# Altium schematic sheet 02ux.SchDoc
size B
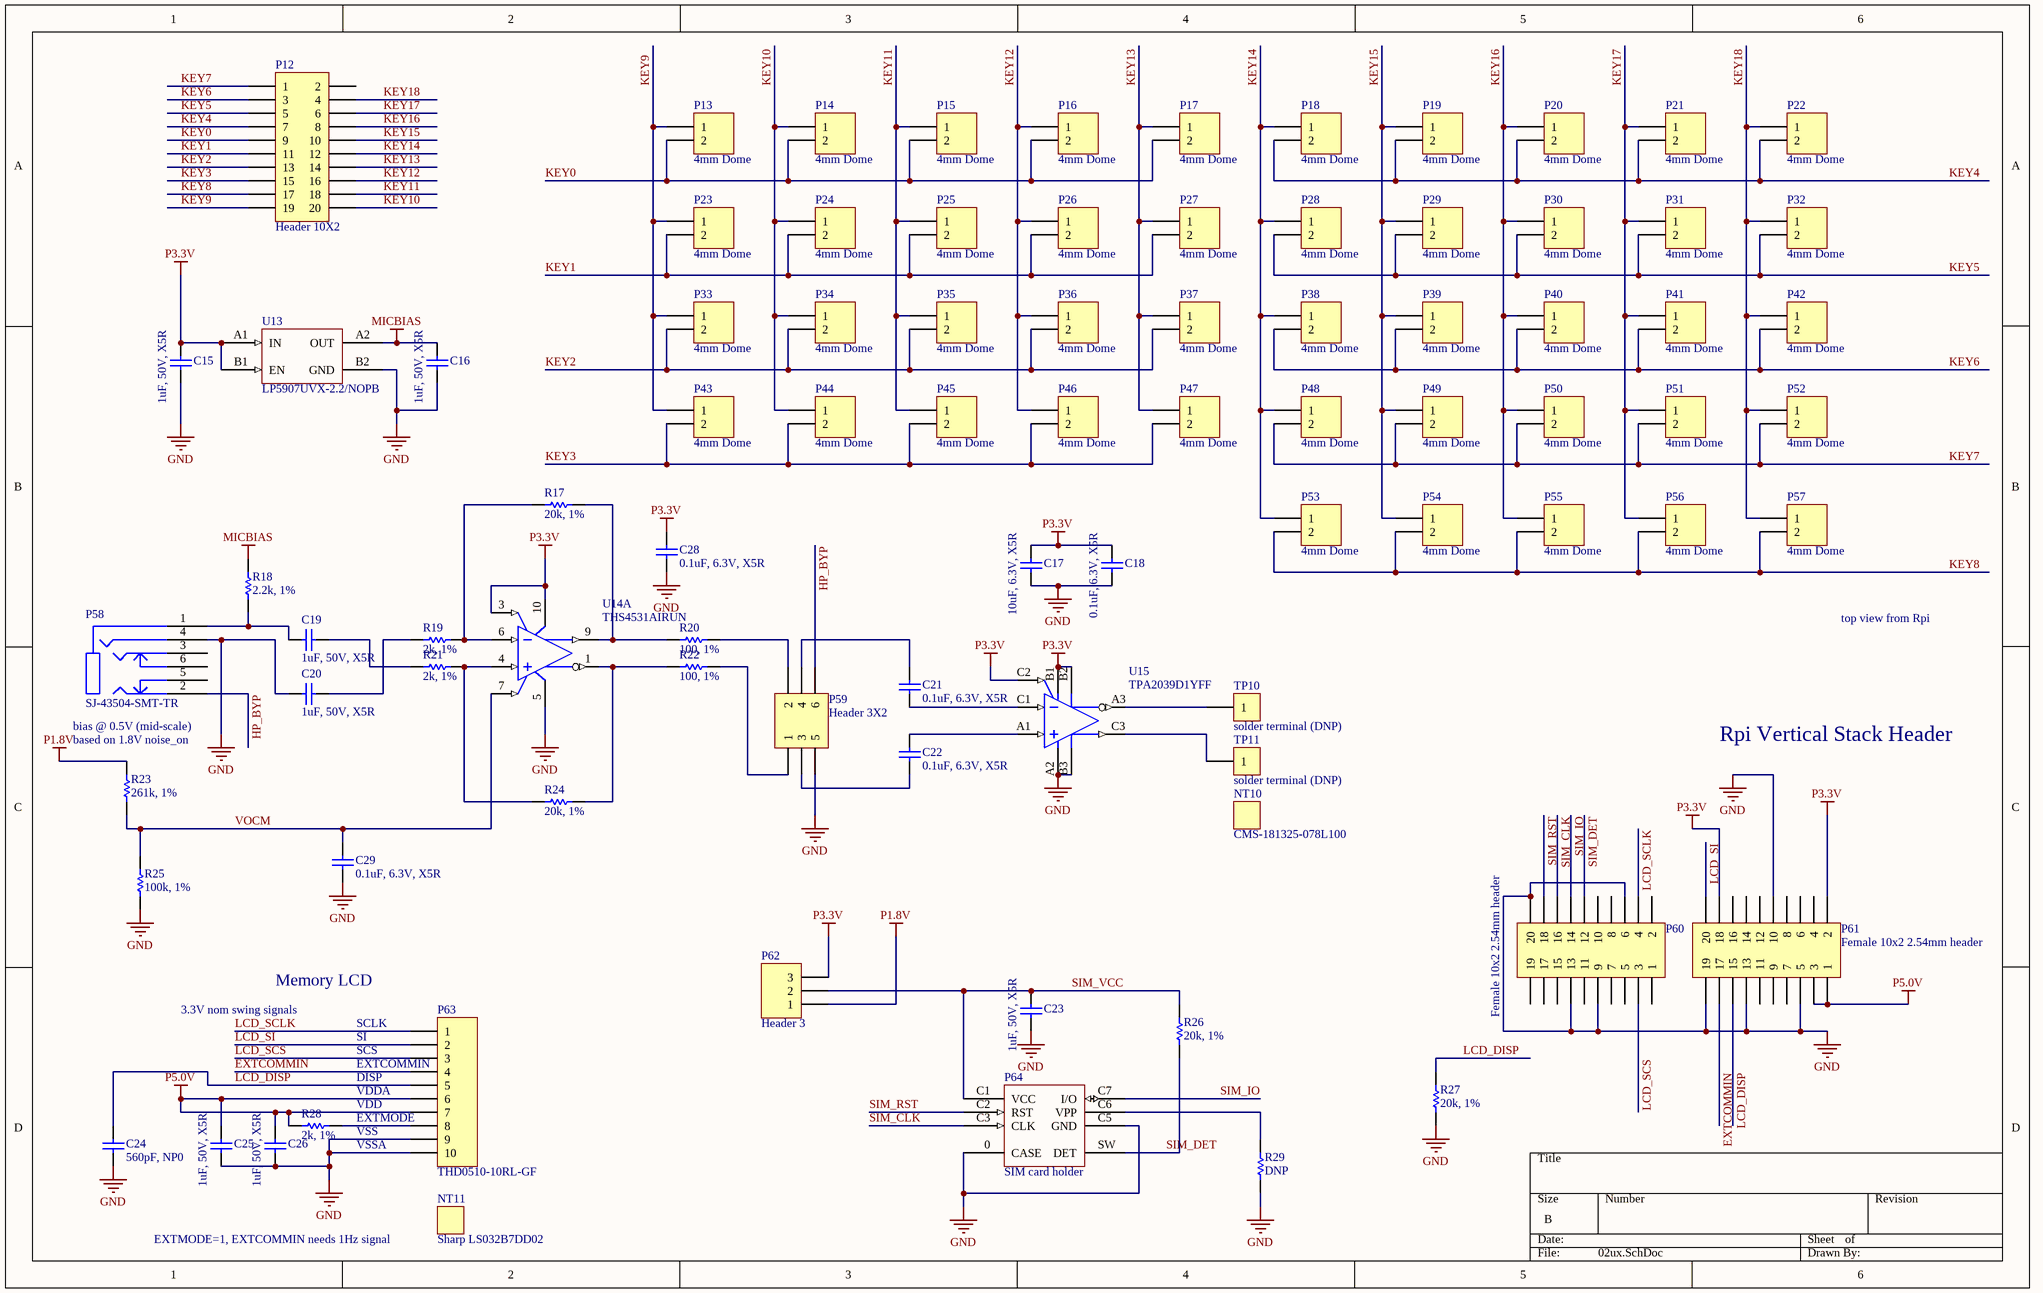
[diagram p0: 02ux.SchDoc]

## Parts
C15  1uF, 50V, X5R  [B_CAP0603]
C16  1uF, 50V, X5R  [B_CAP0603]
C17  10uF, 6.3V, X5R  [B_CAP0603]
C18  0.1uF, 6.3V, X5R  [B_CAP0603]
C19  1uF, 50V, X5R  [B_CAP0603]
C20  1uF, 50V, X5R  [B_CAP0603]
C21  0.1uF, 6.3V, X5R  [B_CAP0603]
C22  0.1uF, 6.3V, X5R  [B_CAP0603]
C23  1uF, 50V, X5R  [B_CAP0603]
C24  560pF, NP0  [B_CAP0402]
C25  1uF, 50V, X5R  [B_CAP0603]
C26  1uF, 50V, X5R  [B_CAP0603]
C28  0.1uF, 6.3V, X5R  [B_CAP0603]
C29  0.1uF, 6.3V, X5R  [B_CAP0603]
NT10  CMS-181325-078L100
NT11  Sharp LS032B7DD02
P12  Header 10X2  [HDR2X10]
P13  4mm Dome  [4MM_DOME_SW]
P14  4mm Dome  [4MM_DOME_SW]
P15  4mm Dome  [4MM_DOME_SW]
P16  4mm Dome  [4MM_DOME_SW]
P17  4mm Dome  [4MM_DOME_SW]
P18  4mm Dome  [4MM_DOME_SW]
P19  4mm Dome  [4MM_DOME_SW]
P20  4mm Dome  [4MM_DOME_SW]
P21  4mm Dome  [4MM_DOME_SW]
P22  4mm Dome  [4MM_DOME_SW]
P23  4mm Dome  [4MM_DOME_SW]
P24  4mm Dome  [4MM_DOME_SW]
P25  4mm Dome  [4MM_DOME_SW]
P26  4mm Dome  [4MM_DOME_SW]
P27  4mm Dome  [4MM_DOME_SW]
P28  4mm Dome  [4MM_DOME_SW]
P29  4mm Dome  [4MM_DOME_SW]
P30  4mm Dome  [4MM_DOME_SW]
P31  4mm Dome  [4MM_DOME_SW]
P32  4mm Dome  [4MM_DOME_SW]
P33  4mm Dome  [4MM_DOME_SW]
P34  4mm Dome  [4MM_DOME_SW]
P35  4mm Dome  [4MM_DOME_SW]
P36  4mm Dome  [4MM_DOME_SW]
P37  4mm Dome  [4MM_DOME_SW]
P38  4mm Dome  [4MM_DOME_SW]
P39  4mm Dome  [4MM_DOME_SW]
P40  4mm Dome  [4MM_DOME_SW]
P41  4mm Dome  [4MM_DOME_SW]
P42  4mm Dome  [4MM_DOME_SW]
P43  4mm Dome  [4MM_DOME_SW]
P44  4mm Dome  [4MM_DOME_SW]
P45  4mm Dome  [4MM_DOME_SW]
P46  4mm Dome  [4MM_DOME_SW]
P47  4mm Dome  [4MM_DOME_SW]
P48  4mm Dome  [4MM_DOME_SW]
P49  4mm Dome  [4MM_DOME_SW]
P50  4mm Dome  [4MM_DOME_SW]
P51  4mm Dome  [4MM_DOME_SW]
P52  4mm Dome  [4MM_DOME_SW]
P53  4mm Dome  [4MM_DOME_SW]
P54  4mm Dome  [4MM_DOME_SW]
P55  4mm Dome  [4MM_DOME_SW]
P56  4mm Dome  [4MM_DOME_SW]
P57  4mm Dome  [4MM_DOME_SW]
P58  SJ-43504-SMT-TR  [CUI_SJ_43504_SMT_TR_PULLBACK]
P59  Header 3X2  [HDR2X3]
P60  Female 10x2 2.54mm header  [HDR2X10]
P61  Female 10x2 2.54mm header  [HDR2X10]
P62  Header 3  [HDR1X3]
P63  THD0510-10RL-GF  [KAWEEI_THD0510_10RL_GF]
P64  SIM card holder  [MOLEX_504520_0691]
R17  20k, 1%  [B_RES0402]
R18  2.2k, 1%  [B_RES0402]
R19  2k, 1%  [B_RES0402]
R20  100, 1%  [B_RES0402]
R21  2k, 1%  [B_RES0402]
R22  100, 1%  [B_RES0402]
R23  261k, 1%  [B_RES0402]
R24  20k, 1%  [B_RES0402]
R25  100k, 1%  [B_RES0402]
R26  20k, 1%  [B_RES0402]
R27  20k, 1%  [B_RES0402]
R28  2k, 1%  [B_RES0402]
R29  DNP  [B_RES0402]
TP10  solder terminal (DNP)  [55-MIL-HOLE]
TP11  solder terminal (DNP)  [55-MIL-HOLE]
U13  LP5907UVX-2.2/NOPB  [TI_YKE004]
U14  THS4531AIRUN  [RUN0010A]  (part A of 2)
U15  TPA2039D1YFF  [YFF0009AAAC]

## Nets
GND: C15.2 C16.2 C17.2 C18.2 C20.1 C23.2 C24.2 C25.2 C26.2 C28.1 C29.1 P58.4(RING2) P59.5 P60.6 P60.9 P60.13 P60.20 P61.5 P61.10 P61.13 P61.19 P63.9 P63.10 P64.0(CASE) P64.C5(GND) R25.1 R27.1 R29.1 U13.B2(GND) U14.5(VS-) U15.A2(GND) U15.B3(PGND)
MICBIAS: C16.1 R18.2 U13.A2(OUT)
P1.8V: P62.1 R23.2
P3.3V: C15.1 C17.1 C18.1 C28.2 P61.2 P61.18 P62.3 U13.A1(IN) U13.B1(EN) U14.3(~{PD}) U14.10(VS+) U15.B1(VDD) U15.B2(PVDD) U15.C2(EN)
P5.0V: C25.1 C26.1 P61.1 P61.3 P63.6 P63.7 R28.2
EXTCOMMIN: P61.17 P63.4
HP_BYP: P58.2(TIP) P59.6
KEY0: P12.9 P13.2 P14.2 P15.2 P16.2 P17.2
KEY1: P12.11 P23.2 P24.2 P25.2 P26.2 P27.2
KEY2: P12.13 P33.2 P34.2 P35.2 P36.2 P37.2
KEY3: P12.15 P43.2 P44.2 P45.2 P46.2 P47.2
KEY4: P12.7 P18.2 P19.2 P20.2 P21.2 P22.2
KEY5: P12.5 P28.2 P29.2 P30.2 P31.2 P32.2
KEY6: P12.3 P38.2 P39.2 P40.2 P41.2 P42.2
KEY7: P12.1 P48.2 P49.2 P50.2 P51.2 P52.2
KEY8: P12.17 P53.2 P54.2 P55.2 P56.2 P57.2
KEY9: P12.19 P13.1 P23.1 P33.1 P43.1
KEY10: P12.20 P14.1 P24.1 P34.1 P44.1
KEY11: P12.18 P15.1 P25.1 P35.1 P45.1
KEY12: P12.16 P16.1 P26.1 P36.1 P46.1
KEY13: P12.14 P17.1 P27.1 P37.1 P47.1
KEY14: P12.12 P18.1 P28.1 P38.1 P48.1 P53.1
KEY15: P12.10 P19.1 P29.1 P39.1 P49.1 P54.1
KEY16: P12.8 P20.1 P30.1 P40.1 P50.1 P55.1
KEY17: P12.6 P21.1 P31.1 P41.1 P51.1 P56.1
KEY18: P12.4 P22.1 P32.1 P42.1 P52.1 P57.1
LCD_DISP: C24.1 P61.15 P63.5 R27.2
LCD_SCLK: P60.4 P63.1
LCD_SCS: P60.3 P63.3
LCD_SI: P61.20 P63.2
SIM_CLK: P60.16 P64.C3(CLK)
SIM_DET: P60.12 P64.SW(DET) R26.1
SIM_IO: P60.14 P64.C7(I/O)
SIM_RST: P60.18 P64.C2(RST)
SIM_VCC: C23.1 P62.2 P64.C1(VCC) R26.2
VOCM: C29.2 R23.1 R25.2 U14.7(VOCM)
NetC19_1: C19.1 P58.1(SLEEVE) R18.1
NetC19_2: C19.2 R21.2
NetC20_2: C20.2 R19.2
NetC21_1: C21.1 U15.C1(IN-)
NetC21_2: C21.2 P59.4
NetC22_1: C22.1 P59.3
NetC22_2: C22.2 U15.A1(IN+)
NetP59_1: P59.1 R22.1
NetP59_2: P59.2 R20.1
NetP63_8: P63.8 R28.1
NetP64_C6: P64.C6(VPP) R29.2
NetR17_1: R17.1 R20.2 U14.9(VOUT+)
NetR17_2: R17.2 R19.1 U14.6(VIN-)
NetR21_1: R21.1 R24.2 U14.4(VIN+)
NetR22_2: R22.2 R24.1 U14.1(VOUT-)
NetTP10_1: TP10.1 U15.A3(VO-)
NetTP11_1: TP11.1 U15.C3(VO+)

Not connected (* = marked no-connect by the designer): P12 2; P58 3(RING1) 5(TIP_SW) 6(RING1_SW); P60 1 2 5 7 8 10 11 15 17 19; P61 4 6 7 8 9 11 12 14 16

## Notes on the sheet
- top view from Rpi
- bias @ 0.5V (mid-scale)
- based on 1.8V noise_on
- Rpi Vertical Stack Header
- 3.3V nom swing signals
- Memory LCD
- SCLK
- SI
- SCS
- (near P63) EXTCOMMIN
- DISP
- VDDA
- (near R28) VDD
- EXTMODE
- (near R28) VSS
- (near R28) VSSA
- EXTMODE=1, EXTCOMMIN needs 1Hz signal

## Library data of the parts
C15 C16 C19 C20 C23 C25 C26 = Cap Semi: Capacitor (Semiconductor SIM Model); MPN: CL10A105KB8NNNC; VENDOR: Samsung; MYPN: C-105-50-X5R-0603
C17 = Cap Semi: Capacitor (Semiconductor SIM Model); MPN: CL10A106MQ8NNNC; VENDOR: Samsung; MYPN: C-106-6.3-X5R-0603
C18 C21 C22 C28 C29 = Cap Semi: Capacitor (Semiconductor SIM Model); MPN: ANY; MYPN: C-104-6.3-X5R-0603; VENDOR: ANY
C24 = Cap Semi: Capacitor (Semiconductor SIM Model); MPN: GRM0335C1E561JA01D; VENDOR: Murata; MYPN: C-561-25-NP0-0201
NT10 = NOTE: Placeholder for non-board BOM items; MYPN: NT-CUI-SPEAKER; VENDOR: CUI; MPN: CMS-181325-078L100
NT11 = NOTE: Placeholder for non-board BOM items; MYPN: NT-LCD-LS032B7DD02; MPN: LS032B7DD02; VENDOR: Sharp
P12 = Header 10X2: Header, 10-Pin, Dual row; LatestRevisionDate: 17-Jul-2002; LatestRevisionNote: Re-released for DXP Platform.; Publisher: Altium Limited
P13-P57 = Header 2: Header, 2-Pin; LatestRevisionDate: 17-Jul-2002; LatestRevisionNote: Re-released for DXP Platform.; Publisher: Altium Limited
P58 = CUI_3.5MM_STEREO_MIC: Mid mount audio jack; VENDOR: CUI; MYPN: J-3.5MM-MID-CUI; MPN: SJ-43504-SMT-TR
P59 = Header 3X2: Header, 3-Pin, Dual row; LatestRevisionDate: 17-Jul-2002; LatestRevisionNote: Re-released for DXP Platform.; Publisher: Altium Limited
P60 P61 = Header 10X2: Header, 10-Pin, Dual row; MPN: F201-SGP-D048-20-P4; VENDOR: KAWAEEI; MYPN: ESW-110-44-L-D; LatestRevisionDate: 17-Jul-2002; LatestRevisionNote: Re-released for DXP Platform.; Publisher: Altium Limited
P62 = Header 3: Header, 3-Pin; LatestRevisionDate: 17-Jul-2002; LatestRevisionNote: Re-released for DXP Platform.; Publisher: Altium Limited
P63 = Header 10: Header, 10-Pin; VENDOR: Kaweei; MYPN: J-FPC-THD0510-10RL-GF; LatestRevisionDate: 17-Jul-2002; LatestRevisionNote: Re-released for DXP Platform.; Publisher: Altium Limited; MPN: THD0510-10RL-GF
P64 = SIM_SLOT: MPN: 504520-0691; VENDOR: MOLEX; MYPN: J-NANOSIM-MOLEX
R17 R24 R26 R27 = Res1: Resistor; VENDOR: ANY; MYPN: R-203-1P-1_16W-0402; MPN: ANY
R18 = Res1: Resistor; VENDOR: ANY; MYPN: R-222-1P-1_16W-0402; MPN: ANY
R19 R21 R28 = Res1: Resistor; VENDOR: ANY; MYPN: R-202-1P-1_16W-0402; MPN: ANY
R20 R22 = Res1: Resistor; VENDOR: ANY; MYPN: R-101-1P-1_16W-0402; MPN: ANY
R23 = Res1: Resistor; VENDOR: ANY; MYPN: R-264-1P-1_16W-0402; MPN: ANY
R25 = Res1: Resistor; VENDOR: ANY; MYPN: R-104-1P-1_16W-0402; MPN: ANY
R29 = Res1: Resistor; VENDOR: ANY; MYPN: DNP; MPN: ANY
TP10 TP11 = CON1: Connector
U13 = LP5907UVX: Ultra low-noise 250mA LDO for RF and analog in DSBGA; VENDOR: TI; MYPN: ULP5907UVX-2.2; MPN: LP5907UVX-2.2/NOPB
U14 = TI-THS4531X-RUN10: Ultra Low-Power, RRIO, Fully Differential Amplifier; MPN: THS4531AIRUN(T/R); VENDOR: TI; MYPN: U-THS4531AIRUN
U15 = TI-TPA20XXD1YFF9: 3.2W Mono Class-D Audio Power Amplifier With 12-dB Gain and Auto Short-Circuit Recovery; MPN: TPA2039D1YFF(T/R); VENDOR: TI; MYPN: U-TPA2039D1YFF